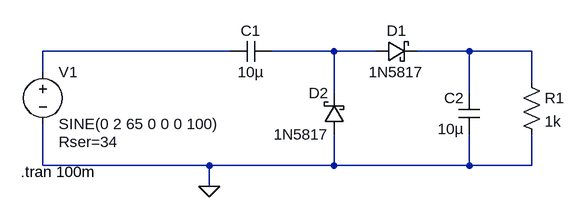
[diagram p0: schematic doubler_harvest.asc]
doubler_harvest.asc, the LTspice schematic file:
Version 4
SHEET 1 880 680
WIRE 320 112 32 112
WIRE 480 112 384 112
WIRE 544 112 480 112
WIRE 688 112 608 112
WIRE 784 112 688 112
WIRE 32 144 32 112
WIRE 784 160 784 112
WIRE 480 176 480 112
WIRE 688 176 688 112
WIRE 32 288 32 224
WIRE 288 288 32 288
WIRE 480 288 480 240
WIRE 480 288 288 288
WIRE 688 288 688 240
WIRE 688 288 480 288
WIRE 784 288 784 240
WIRE 784 288 688 288
WIRE 288 320 288 288
FLAG 288 320 0
SYMBOL voltage 32 128 R0
WINDOW 123 0 0 Left 2
WINDOW 39 24 124 Left 2
SYMATTR InstName V1
SYMATTR Value SINE(0 2 65 0 0 0 100)
SYMATTR SpiceLine Rser=34
SYMBOL schottky 544 128 R270
WINDOW 0 32 32 VTop 2
WINDOW 3 0 32 VBottom 2
SYMATTR InstName D1
SYMATTR Value 1N5817
SYMATTR Description Diode
SYMATTR Type diode
SYMBOL schottky 496 240 R180
WINDOW 0 24 64 Left 2
WINDOW 3 24 0 Left 2
SYMATTR InstName D2
SYMATTR Value 1N5817
SYMATTR Description Diode
SYMATTR Type diode
SYMBOL cap 384 96 R90
WINDOW 0 0 32 VBottom 2
WINDOW 3 32 32 VTop 2
SYMATTR InstName C1
SYMATTR Value 10µ
SYMBOL cap 704 240 R180
WINDOW 0 24 56 Left 2
WINDOW 3 24 8 Left 2
SYMATTR InstName C2
SYMATTR Value 10µ
SYMBOL res 768 144 R0
SYMATTR InstName R1
SYMATTR Value 1k
TEXT -2 298 Left 2 !.tran 100m

The netlist it stands for:
* doubler_harvest.asc
V1 N001 0 SINE(0 2 65 0 0 0 100) Rser=34
D1 N002 N003 1N5817
D2 0 N002 1N5817
C1 N002 N001 10µ
C2 0 N003 10µ
R1 N003 0 1k
.model D D
.lib standard.dio
.tran 100m
.backanno
.end